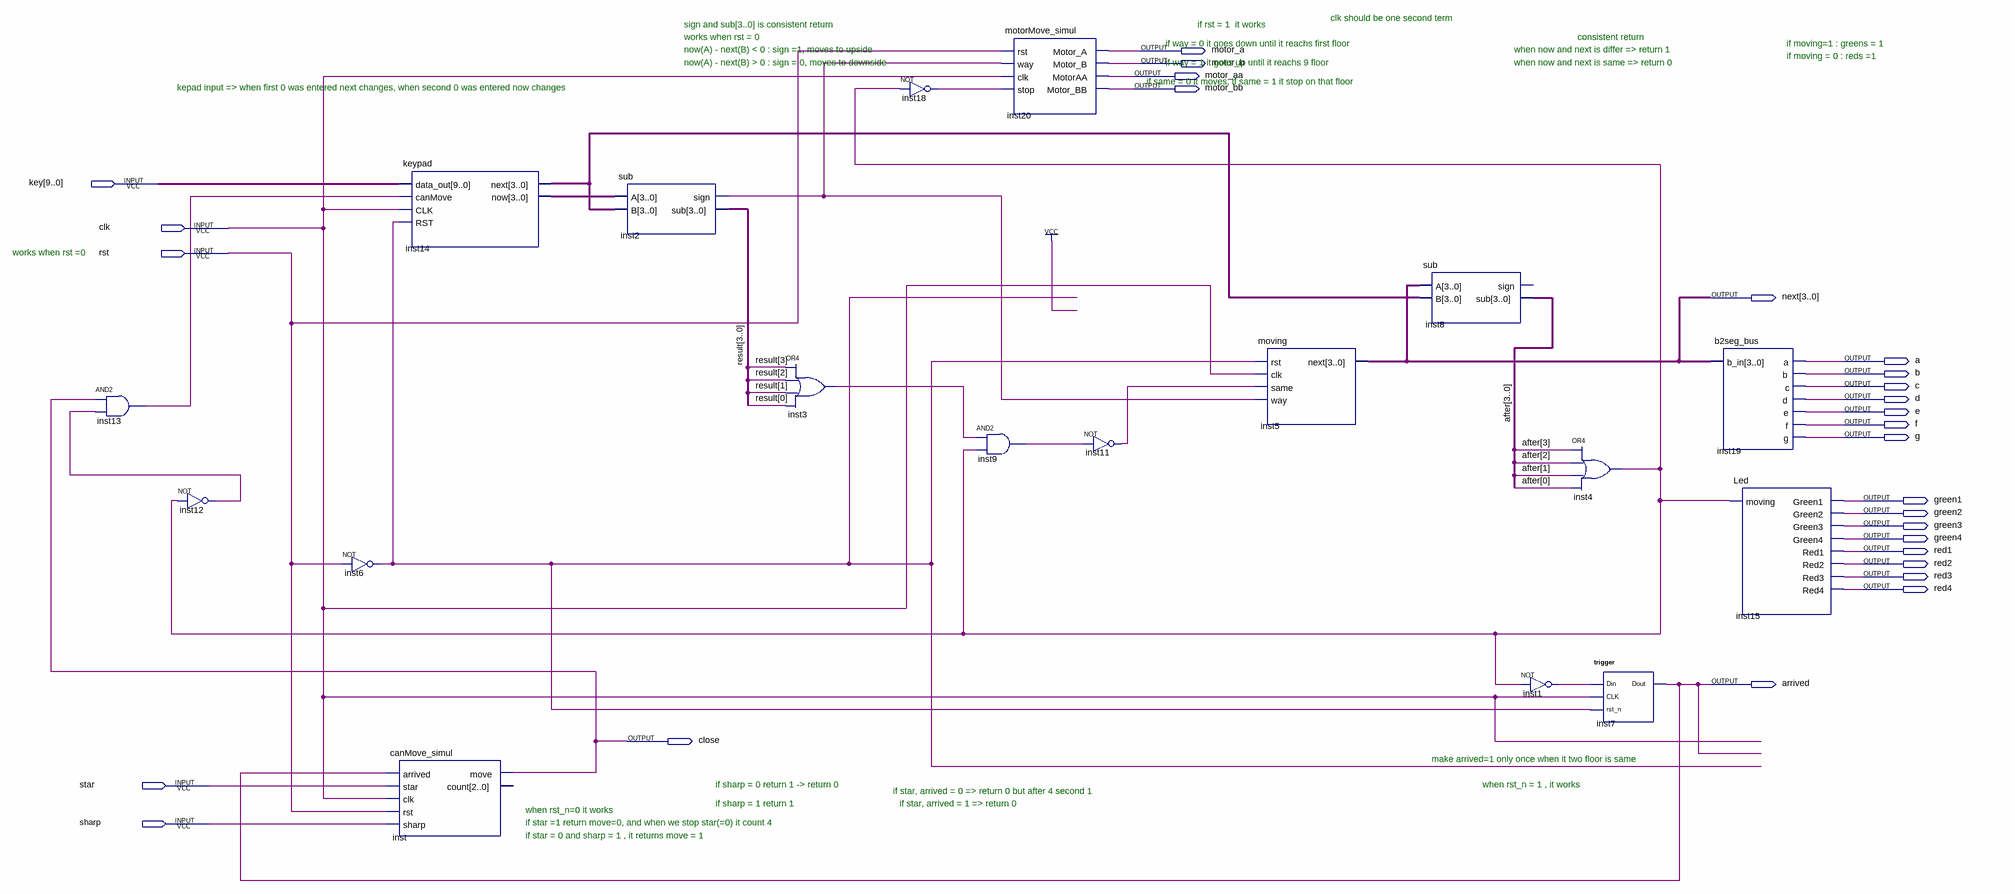
[diagram p0: schematic sheet]
// Quartus schematic elevator_simul.bdf as structural Verilog: 18 symbols, 27 pins
module elevator_simul (
  input  [9:0] key,
  input  clk,
  input  rst,
  input  star,
  input  sharp,
  output motor_a,
  output motor_b,
  output motor_aa,
  output motor_bb,
  output [3:0] next,
  output a,
  output b,
  output c,
  output d,
  output e,
  output f,
  output g,
  output green1,
  output green2,
  output green3,
  output green4,
  output red1,
  output red2,
  output red3,
  output red4,
  output arrived,
  output close
);

  wire inst1_out, inst2_sign, inst3_out, inst4_out, inst6_out, inst9_out, inst11_out, inst12_out, inst13_out,
       inst18_out;
  wire [3:0] after, inst14_next, inst14_now, result;

  and inst13 (inst13_out, close, inst12_out);
  not inst12 (inst12_out, inst4_out);
  not inst6 (inst6_out, rst);
  keypad inst14 (
    .data_out(key), .canMove(inst13_out), .CLK(clk), .RST(inst6_out), .next(inst14_next), .now(inst14_now));
  canMove_simul inst (
    .arrived(arrived), .star(star), .clk(clk), .rst(rst), .sharp(sharp), .move(close));  // open: count
  sub inst2 (.A(inst14_now), .B(inst14_next), .sign(inst2_sign), .sub(result));
  or inst3 (inst3_out, result[3], result[2], result[1], result[0]);
  not inst18 (inst18_out, inst4_out);
  and inst9 (inst9_out, inst3_out, inst4_out);
  motorMove_simul inst20 (
    .rst(rst), .way(inst2_sign), .clk(clk), .stop(inst18_out), .Motor_A(motor_a), .Motor_B(motor_b),
    .MotorAA(motor_aa), .Motor_BB(motor_bb));
  not inst11 (inst11_out, inst9_out);
  moving inst5 (.rst(inst6_out), .clk(clk), .same(inst11_out), .way(inst2_sign), .next(next));
  sub inst8 (.A(next), .B(inst14_next), .sub(after));  // open: sign
  not inst1 (inst1_out, inst4_out);
  or inst4 (inst4_out, after[3], after[2], after[1], after[0]);
  trigger inst7 (.Din(inst1_out), .CLK(clk), .rst_n(inst6_out), .Dout(arrived));
  b2seg_bus inst19 (.b_in(next), .a(a), .b(b), .c(c), .d(d), .e(e), .f(f), .g(g));
  Led inst15 (
    .moving(inst4_out), .Green1(green1), .Green2(green2), .Green3(green3), .Green4(green4), .Red1(red1),
    .Red2(red2), .Red3(red3), .Red4(red4));

  // Notes on the sheet:
  //   clk should be one second term
  //   sign and sub[3..0] is consistent return
  //   if rst = 1  it works
  //   works when rst = 0
  //   consistent return
  //   if way = 0 it goes down until it reachs first floor
  //   if moving=1 : greens = 1
  //   now(A) - next(B) < 0 : sign =1, moves to upside
  //   when now and next is differ => return 1
  //   if moving = 0 : reds =1
  //   now(A) - next(B) > 0 : sign = 0, moves to downside
  //   if way = 1 it goes up until it reachs 9 floor
  //   when now and next is same => return 0
  //   if same = 0 it moves, if same = 1 it stop on that floor
  //   kepad input => when first 0 was entered next changes, when second 0 was entered now changes
  //   works when rst =0
  //   make arrived=1 only once when it two floor is same 
  //   if sharp = 0 return 1 -> return 0
  //   when rst_n = 1 , it works
  //   if star, arrived = 0 => return 0 but after 4 second 1
  //   if sharp = 1 return 1
  //   if star, arrived = 1 => return 0
  //   when rst_n=0 it works
  //   if star =1 return move=0, and when we stop star(=0) it count 4
  //   if star = 0 and sharp = 1 , it returns move = 1
endmodule
